# Altium schematic sheet Block Diagram.SchDoc: B202AA Block Diagram
size 292 x 193 mm; SheetNumber: 1; SheetTotal: 8
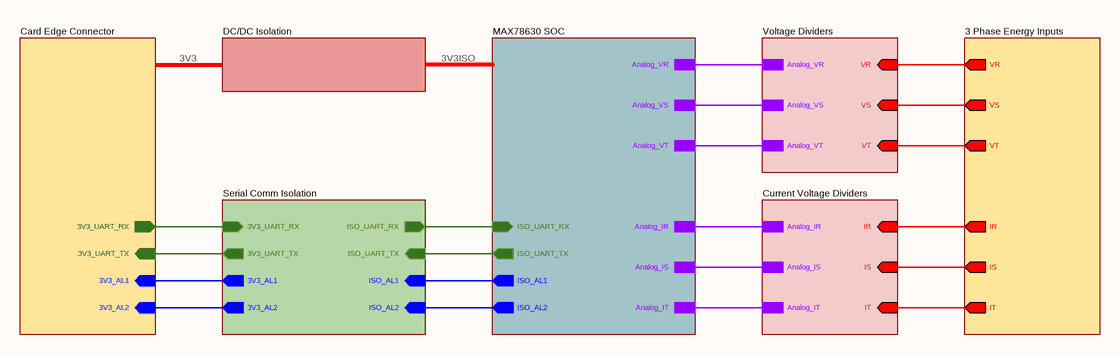
[diagram p0: Block Diagram.SchDoc]

## Sub-sheets
3 Phase Energy Inputs = Energy Inputs.SchDoc: VS (out), VR (out), IS (out), IT (out), VT (out), IR (out)
Card Edge Connector = Card Edge Connecgtor.SchDoc: 3V3_UART_RX (out), 3V3_UART_TX (in), 3V3_AL1 (in), 3V3_AL2 (in)
Current Voltage Dividers = Current Voltage Dividers.SchDoc: Analog_IS, Analog_IT, Analog_IR, IT (in), IS (in), IR (in)
DC/DC Isolation = Power Isolation.SchDoc: no entries
MAX78630 SOC = MAX78630 SOC.SchDoc: Analog_VR, Analog_VS, Analog_VT, Analog_IS, Analog_IT, Analog_IR, ISO_UART_RX (in), ISO_UART_TX (out), ISO_AL1 (out), ISO_AL2 (out)
Serial Comm Isolation = Signal Isolation.SchDoc: 3V3_UART_TX (out), 3V3_UART_RX (in), ISO_UART_RX (out), ISO_UART_TX (in), ISO_AL2 (in), 3V3_AL2 (out), 3V3_AL1 (out), ISO_AL1 (in)
Voltage Dividers = Phase Voltage Dividers.SchDoc: Analog_VR, Analog_VS, Analog_VT, VR (in), VT (in), VS (in)

## Nets
(unnamed): sheet MAX78630 SOC/Analog_VR, sheet Voltage Dividers/Analog_VR
(unnamed): sheet MAX78630 SOC/Analog_VS, sheet Voltage Dividers/Analog_VS
(unnamed): sheet MAX78630 SOC/Analog_VT, sheet Voltage Dividers/Analog_VT
(unnamed): sheet MAX78630 SOC/Analog_IS, sheet Current Voltage Dividers/Analog_IS
(unnamed): sheet MAX78630 SOC/Analog_IT, sheet Current Voltage Dividers/Analog_IT
(unnamed): sheet MAX78630 SOC/Analog_IR, sheet Current Voltage Dividers/Analog_IR
(unnamed): sheet MAX78630 SOC/ISO_UART_RX, sheet Serial Comm Isolation/ISO_UART_RX
(unnamed): sheet MAX78630 SOC/ISO_UART_TX, sheet Serial Comm Isolation/ISO_UART_TX
(unnamed): sheet MAX78630 SOC/ISO_AL1, sheet Serial Comm Isolation/ISO_AL1
(unnamed): sheet MAX78630 SOC/ISO_AL2, sheet Serial Comm Isolation/ISO_AL2
(unnamed): sheet Voltage Dividers/VR, sheet 3 Phase Energy Inputs/VR
(unnamed): sheet Voltage Dividers/VT, sheet 3 Phase Energy Inputs/VT
(unnamed): sheet Voltage Dividers/VS, sheet 3 Phase Energy Inputs/VS
(unnamed): sheet Current Voltage Dividers/IT, sheet 3 Phase Energy Inputs/IT
(unnamed): sheet Current Voltage Dividers/IS, sheet 3 Phase Energy Inputs/IS
(unnamed): sheet Current Voltage Dividers/IR, sheet 3 Phase Energy Inputs/IR
(unnamed): sheet Serial Comm Isolation/3V3_UART_TX, sheet Card Edge Connector/3V3_UART_TX
(unnamed): sheet Serial Comm Isolation/3V3_UART_RX, sheet Card Edge Connector/3V3_UART_RX
(unnamed): sheet Serial Comm Isolation/3V3_AL2, sheet Card Edge Connector/3V3_AL2
(unnamed): sheet Serial Comm Isolation/3V3_AL1, sheet Card Edge Connector/3V3_AL1

## Notes on the sheet
- 3V3
- 3V3ISO
- © 2021 All rights reserved.
  This document may not, in whole or in part, be copied, photocopied, reproduced, translated or converted to any electronic or machine readable from without prior written permission of Mehmet Günce Akkoyun.
  Engineer contact : akkoyun@me.com
- Property of
- Engineer :
- Date :
- Size :
- A4
- Time :
- Project :
- Page :
- /
- Customer :
- Product ID :
- Module ID :
- Version :
- File :
- Revision :